# Altium schematic sheet Waveform Generator Design.SchDoc
size A; SheetNumber: 10; SheetTotal: 10
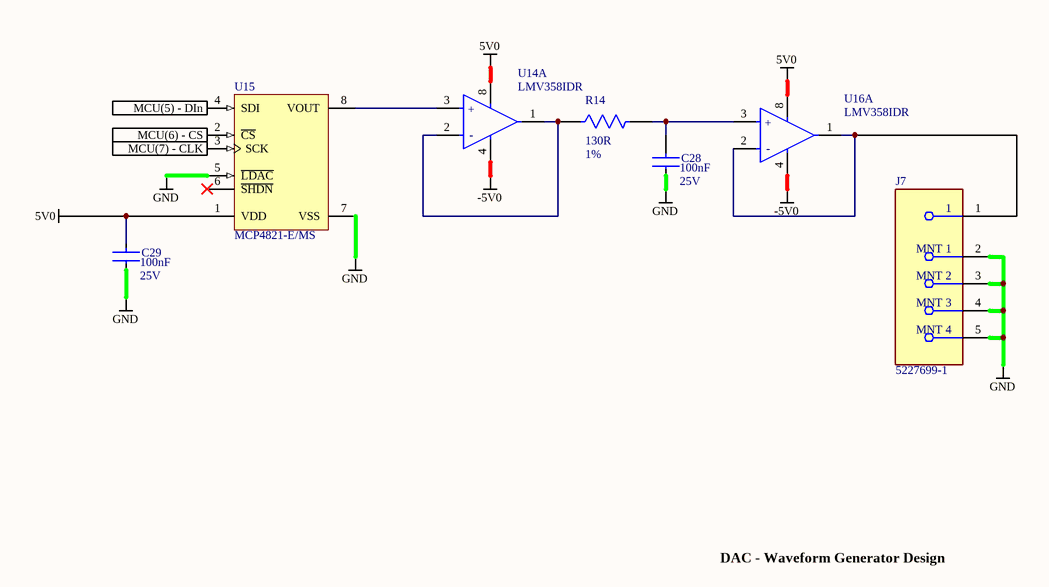
[diagram p0: Waveform Generator Design.SchDoc]

## Parts
C28  Voltage Rating: 25V  Capacitance: 100nF  [FP-CL278-IPC_C]  (hidden comment: 0.1 uF)
C29  Voltage Rating: 25V  Capacitance: 100nF  [FP-CL278-IPC_C]  (hidden comment: 0.1 uF)
J7  5227699-1  [FP-5227699-1-MFG]
R14  Tolerance: 1%  Resistance: 130R  [FP-CRCW2512-e3-IPC_C]  (hidden comment: 130 Ohm)
U14  LMV358IDR  [FP-D0008A-MFG]  (part A of 2)
U15  MCP4821-E/MS  [MSOP-MS8_N]
U16  LMV358IDR  [FP-D0008A-MFG]  (part A of 2)

## Ports
MCU(5) - DIn (in), MCU(6) - CS (in), MCU(7) - CLK (in)

## Nets
5V0: C29.1 U14.8(VCC+) U15.1(VDD) U16.8(VCC+)
-5V0: U14.4(GND) U16.4(GND)
GND: C28.2 C29.2 J7.2(MNT_1) J7.3(MNT_2) J7.4(MNT_3) J7.5(MNT_4) U15.5(~{LDAC}) U15.7(VSS)
MCU(5) - DIn: U15.4(SDI) ; port MCU(5) - DIn
MCU(6) - CS: U15.2(~{CS}) ; port MCU(6) - CS
MCU(7) - CLK: U15.3(SCK) ; port MCU(7) - CLK
NetC28_1: C28.1 R14.2 U16.3(1IN+)
NetJ7_1: J7.1 U16.1(OUT) U16.2(1IN-)
NetR14_1: R14.1 U14.1(OUT) U14.2(1IN-)
NetU14_3: U14.3(1IN+) U15.8(VOUT)

Not connected (* = marked no-connect by the designer): U15 6(~{SHDN})*

## Notes on the sheet
- DAC - Waveform Generator Design
- (in symbol CMP-04895-000136-1, part A) +; -

## Library data of the parts
C28 C29 = CMP-13271-000728-1: Cap Ceramic 100nF 25V X5R ±10% SMD 0402 +85°C Paper T/R; Package Quantity: 1; Height: 0.5mm; Case Code (Metric): 1005; Thickness: 0.022inch; Mount: Surface Mount; Lead Free: Lead Free; Case Code (Imperial): 0402; Packaging: Tape and Reel; Depth: 0.5mm; Voltage: 25V; Min Operating Temperature: -55°C; Dielectric: X5R; Case/Package: 0402; Tolerance: 10%; Width: 0.02inch; Max Operating Temperature: 85°C; Length: 1mm; Radiation Hardening: No; Voltage Rating (DC): 25V
J7 = CMP-03357-000003-1: CONN BNC JACK STR 50 OHM PCB; Frequency: 4GHz; Number of Positions: 1; Body Plating: Nickel; Gender: Female; PCB Mount Retention: Without; Polarity: Standard; Body Material: Zinc; Voltage Rating: 500V; Sealable: No (Without); PCB Mounting Orientation: Vertical; Impedance: 50R; Insulation Resistance: 5GR; Orientation: Straight; Package Quantity: 30; ELV: Compliant; Min Operating Temperature: -55°C; Length: 17.45mm; Termination: Solder; Connector Type: BNC; Fastening Type: Bayonet; Contact Plating: Silver; Depth: 17.45mm; Contact Material: Bronze; Max Frequency: 4GHz; Max Operating Temperature: 85°C; Radiation Hardening: No; Mount: Through Hole; Lead Free: Lead Free; Packaging: Rail/Tube
R14 = CMP-1018-00409-2: RES Thick Film, 130Ω, 1%, 1W, 100ppm/°C, 2512; Voltage Rating (DC): 500V; Weight: 0.001429oz; Max Power Dissipation: 1W; REACH SVHC: No SVHC; Case Code (Imperial): 2512; Lead Free: Lead Free; Width: 0.124inch; Number of Terminations: 2; Min Operating Temperature: -55°C; Temperature Coefficient: 100ppm/°C; Features: Automotive AEC-Q200; Case/Package: 2512; Contact Plating: Tin; Max Operating Temperature: 155°C; Power Rating: 1W; Case Code (Metric): 6432; Height: 0.028inch; Composition: Thick Film; Voltage Rating: 500V; Packaging: Tape and Reel; Package Quantity: 10; Length: 0.248inch; Number of Pins: 2; Radiation Hardening: No
U14 U16 = CMP-04895-000136-1: IC OPAMP GP 2 CIRCUIT 8SOIC; Number of Elements: 2; Min Supply Voltage: 2.7V; Input Bias Current: 250nA; Output Current per Channel: 160mA; Bandwidth: 1MHz; Voltage Gain: 100dB; Input Offset Voltage (Vos): 7mV; Slew Rate: 1V/µs; Nominal Supply Current: 440uA; Power Supply Rejection Ratio (PSRR): 50dB; Max Supply Voltage: 5.5V; Operating Supply Current: 210uA; Lead Free: Lead Free; Length: 4.9mm; RoHS Compliant: Yes; REACH SVHC: No SVHC; Case/Package: SOIC; Height: 1.58mm; Number of Channels: 2; Number of Amplifiers: 2; Radiation Hardening: No; Number of Circuits: 2; Mount: Surface Mount; Contact Plating: Gold; Unity Gain Bandwidth Product: 1MHz; Min Operating Temperature: -40°C; Max Operating Temperature: 125°C; Width: 3.91mm; Gain Bandwidth Product: 1MHz; Number of Pins: 8; Packaging: Tape and Reel; Package Quantity: 2500; Output Current: 160mA; Common Mode Rejection Ratio: 50dB
U15 = CMP-0188-00871-2: 12-Bit DACs with Internal VREF and SPI Interface, 8-Pin MSOP, Extended Temperature; PackageReference: MSOP-MS8; ComponentLink1URL: http://www.microchip.com/; RevisionNote: URLs added. DatasheetVersion updated. Sch updated.; ComponentLink2URL: http://ww1.microchip.com/downloads/en/DeviceDoc/22244B.pdf; PackageDescription: 8-Lead Plastic Micro Small Outline Package (MS) [MSOP]; PackageVersion: revBB, Aug-2009; ComponentLink3URL: http://www.microchip.com/stellent/groups/techpub_sg/documents/packagingspec/en012702.pdf; ComponentLink2Description: Datasheet; DatasheetVersion: revB, Apr-2010; ComponentLink3Description: Package Specification; ComponentLink1Description: Manufacturer URL